# Altium schematic sheet optron_ku_2ch.SchDoc: =GlobalProjectName
size 209 x 297 mm; SheetNumber: 10; SheetTotal: 10; PageSetup: Record=PageOptions|CenterHorizontal=True|CenterVertical=True|PrintScale=1.00|XCorrection=1.00|YCorrection=1.00|PrintKind=1|BorderSize=5000000|LeftOffset=0|BottomOffset=0|Orientation=2|PaperLength=1000|PaperWidth=1000|Scale=100|PaperSource=15|PrintQuality=1200|MediaType=1|DitherType=10|PaperKind=A3|PrintScaleMode=1; Weight: -; ScaleFactor: -
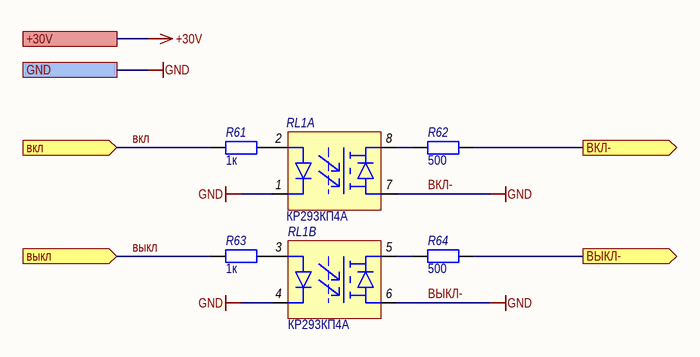
[diagram p0: optron_ku_2ch.SchDoc]

## Parts
R61  1к  [SMD_0805]
R62  500  [SMD_0805]
R63  1к  [SMD_0805]
R64  500  [SMD_0805]
RL1  KR293KP4A  [DIP-8]  (value not drawn)  (parts A,B of 2)

## Ports
+30V, GND, вкл (in), ВКЛ- (out), выкл (in), ВЫКЛ- (out)

## Nets
+30V: port +30V
ВКЛ-: RL1.1 RL1.4 RL1.6 RL1.7 ; port GND  [also labelled GND, ВЫКЛ-]
вкл: R61.1 ; port вкл
ВКЛ-: R62.2 ; port ВКЛ-  [a separate net that carries the same name]
выкл: R63.1 ; port выкл
ВЫКЛ-: R64.2 ; port ВЫКЛ-
NetR61_2: R61.2 RL1.2
NetR62_1: R62.1 RL1.8
NetR63_2: R63.2 RL1.3
NetR64_1: R64.1 RL1.5

## Notes on the sheet
- Подп. и дата
- Инв. № дубл.
- Взам. инв. №
- Инв. № подл.
- Изм.
- Лист
- № докум.
- Подп.
- Дата
- Форма 2а ГОСТ 2.104-2006
- Копировал
- Формат А4

## Library data of the parts
R61-R64 = Resistor: Наименование: Резистор; Назначение: SMD-резистор; Потребление, Вт: 0,001
  R61 R63: Value: 1к
  R62 R64: Value: 500
RL1 = КР293КП4А: Сдвоенное однонаправленное МОП-реле с низким сопротивлением / 60В/2.5Ом; Потребление, Вт: 0,001; Назначение: Сдвоенное однонаправленное МОП-реле с низким сопротивлением; ComponentLink1Description: DataSheet; ComponentLink1URL: https://static.chipdip.ru/lib/242/DOC000242149.pdf; Наименование: КР293КП4А